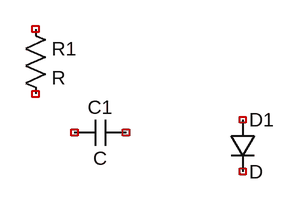
[diagram p0: schematic Draft1.asc]
Draft1.asc, the LTspice schematic file:
Version 4
SHEET 1 880 680
SYMBOL res 32 96 R0
SYMATTR InstName R1
SYMBOL cap 160 224 R90
WINDOW 0 0 32 VBottom 2
WINDOW 3 32 32 VTop 2
SYMATTR InstName C1
SYMBOL diode 288 224 R0
SYMATTR InstName D1

The netlist it stands for:
* Draft1.asc
R1 NC_01 NC_02 R
C1 NC_03 NC_04 C
D1 NC_05 NC_06 D
.model D D
.lib standard.dio
.backanno
.end